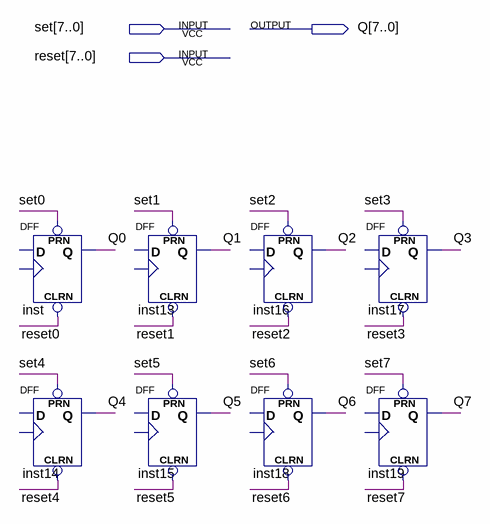
[diagram p0: schematic sheet]
// Quartus schematic BTN_REG8.bdf as structural Verilog: 8 symbols, 3 pins
module BTN_REG8 (
  input  [7:0] set,
  input  [7:0] reset,
  output [7:0] Q
);

  DFF inst (.CLRN(reset[0]), .PRN(set[0]), .Q(Q[0]));  // open: CLK, D
  DFF inst14 (.CLRN(reset[4]), .PRN(set[4]), .Q(Q[4]));  // open: CLK, D
  DFF inst13 (.CLRN(reset[1]), .PRN(set[1]), .Q(Q[1]));  // open: CLK, D
  DFF inst15 (.CLRN(reset[5]), .PRN(set[5]), .Q(Q[5]));  // open: CLK, D
  DFF inst16 (.CLRN(reset[2]), .PRN(set[2]), .Q(Q[2]));  // open: CLK, D
  DFF inst18 (.CLRN(reset[6]), .PRN(set[6]), .Q(Q[6]));  // open: CLK, D
  DFF inst17 (.CLRN(reset[3]), .PRN(set[3]), .Q(Q[3]));  // open: CLK, D
  DFF inst19 (.CLRN(reset[7]), .PRN(set[7]), .Q(Q[7]));  // open: CLK, D
endmodule
